# Altium schematic sheet Filter.schdoc: Filter
size A4; Organization: Altium Limited; Address1: L3, 12a Rodborough Rd; Address2: Frenchs Forest; Address3: NSW; Address4: Australia 2086; DocumentNumber: 1; SheetNumber: 1; SheetTotal: 1
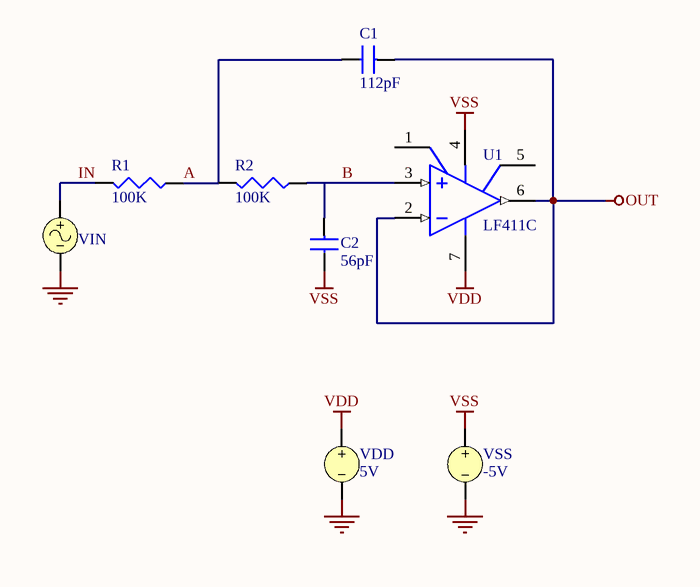
[diagram p0: Filter.schdoc]

## Parts
C1  112pF
C2  56pF
R1  100K
R2  100K
U1  LF411C
VDD  5V
VIN  VSIN  (value not drawn)
VSS  -5V

## Nets
GND: VDD.2 VIN.2 VSS.2
OUT: C1.1 U1.2(IN-) U1.6(OUT)
VDD: U1.7(VCC+) VDD.1
VSS: C2.2 U1.4(VCC_-) VSS.1
A: C1.2 R1.2(BOT) R2.1(TOP)
B: C2.1 R2.2(BOT) U1.3(IN+)
IN: R1.1(TOP) VIN.1

Not connected (* = marked no-connect by the designer): U1 1(OS_NULL-) 5(OS_NULL+)

## Notes on the sheet
- Title
- Size:
- Date:
- A4
- Number:
- Time:
- Revision:
- Sheet
- of
- File:

## Library data of the parts
C1 C2 = CAP: Capacitor
  C1: Value: 112pF
  C2: Value: 56pF
R1 R2 = RES: Resistor; Value: 100K
U1 = LF411C: Wide Bandwidth JFET Input Operational Amplifier
VDD VSS = VSRC: Voltage Source
  VDD: Value: 5V
  VSS: Value: -5V
VIN = VSIN: Sinusoidal Voltage Source